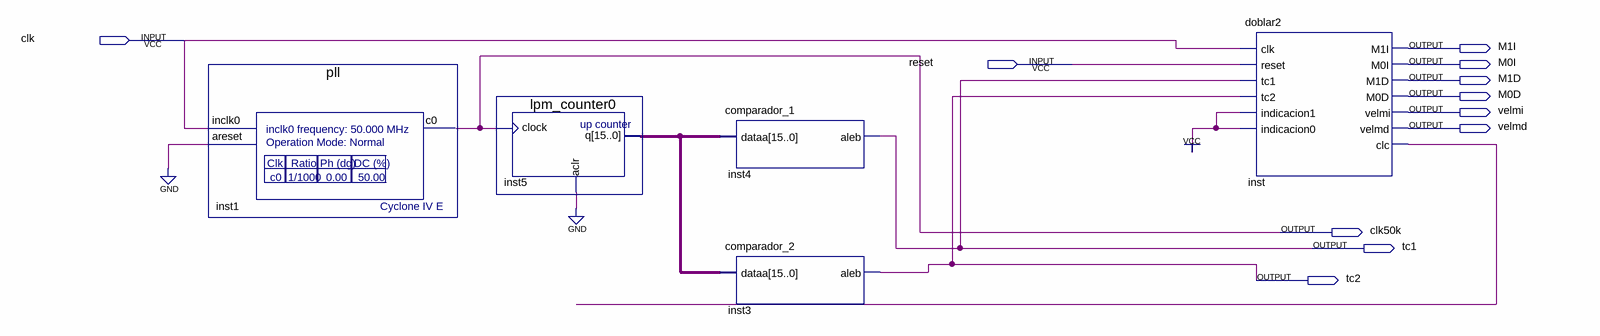
[diagram p0: schematic sheet]
// Quartus schematic prueba1.bdf as structural Verilog: 5 symbols, 11 pins
module prueba1 (
  input  clk,
  input  reset,
  output M1I,
  output M0I,
  output M1D,
  output M0D,
  output velmi,
  output velmd,
  output clk50k,
  output tc1,
  output tc2
);

  wire inst_clc;
  wire [15:0] inst5_q;

  pll inst1 (.inclk0(clk), .areset(1'b0), .c0(clk50k));
  lpm_counter0 inst5 (.clock(clk50k), .aclr(1'b0), .q(inst5_q));
  comparador_1 inst4 (.dataa(inst5_q), .aleb(tc1));
  comparador_2 inst3 (.dataa(inst5_q), .aleb(tc2));
  doblar2 inst (
    .clk(clk), .reset(reset), .tc1(tc1), .tc2(tc2), .indicacion1(1'b1), .indicacion0(1'b1), .M1I(M1I),
    .M0I(M0I), .M1D(M1D), .M0D(M0D), .velmi(velmi), .velmd(velmd), .clc(inst_clc));
endmodule
